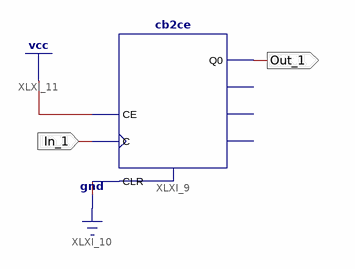
[diagram p0: schematic sheet 1]
// Xilinx ISE schematic bn_count2.sch (spartan6) as structural Verilog: 1 symbols, 2 ports
module bn_count2 (
  input  In_1,
  output Out_1
);

  cb2ce XLXI_9 (.C(In_1), .CE(1'b1), .CLR(1'b0), .Q0(Out_1));  // open: CEO, Q1, TC
endmodule
